# EAGLE schematic jellyFish_schematic (EAGLE 9.6.2)
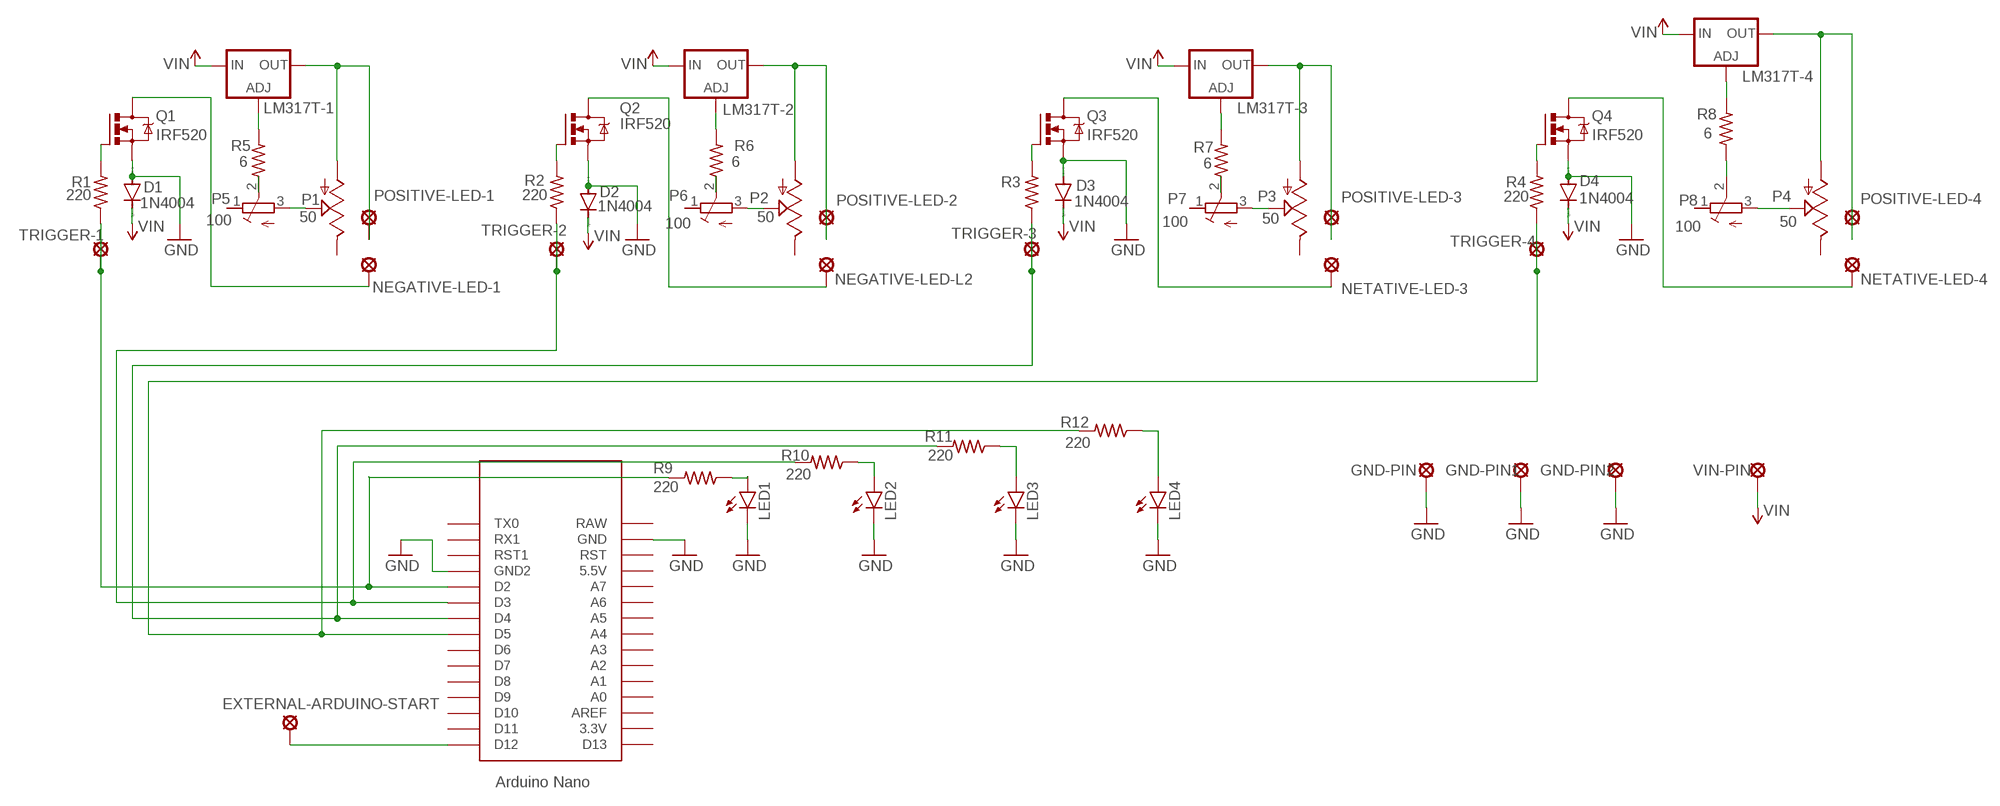
[diagram p0: schematic, sheet 1]

## Parts
D1  1N4004  [DO41-10]
D2  1N4004  [DO41-10]
D3  1N4004  [DO41-10]
D4  1N4004  [DO41-10]
EXTERNAL-ARDUINO-START  LSP10  [LSP10]
GND-PIN  LSP10  [LSP10]
GND-PIN1  LSP10  [LSP10]
GND-PIN2  LSP10  [LSP10]
LED1  LEDCHIPLED_0805  [CHIPLED_0805]
LED2  LEDCHIPLED_0805  [CHIPLED_0805]
LED3  LEDCHIPLED_0805  [CHIPLED_0805]
LED4  LEDCHIPLED_0805  [CHIPLED_0805]
LM317T-1  LM317TS  [317TS]
LM317T-2  LM317TS  [317TS]
LM317T-3  LM317TS  [317TS]
LM317T-4  LM317TS  [317TS]
NEGATIVE-LED-1  LSP10  [LSP10]
NEGATIVE-LED-L2  LSP10  [LSP10]
NETATIVE-LED-3  LSP10  [LSP10]
NETATIVE-LED-4  LSP10  [LSP10]
P1  50  TRIM_US-S63P  [S63P]
P2  50  TRIM_US-S63P  [S63P]
P3  50  TRIM_US-S63P  [S63P]
P4  50  TRIM_US-S63P  [S63P]
P5  100  R-TRIMMT93YA  [RTRIMT93YA]
P6  100  R-TRIMMT93YA  [RTRIMT93YA]
P7  100  R-TRIMMT93YA  [RTRIMT93YA]
P8  100  R-TRIMMT93YA  [RTRIMT93YA]
POSITIVE-LED-1  POSITIVE LED  LSP10  [LSP10]
POSITIVE-LED-2  LSP10  [LSP10]
POSITIVE-LED-3  LSP10  [LSP10]
POSITIVE-LED-4  LSP10  [LSP10]
Q1  IRF520  [TO220BV]
Q2  IRF520  [TO220BV]
Q3  IRF520  [TO220BV]
Q4  IRF520  [TO220BV]
R1  220  R-US_R0805  [R0805]
R2  220  R-US_R0805  [R0805]
R3  220  R-US_R0805  [R0805]
R4  220  R-US_R0805  [R0805]
R5  6  R-US_R0805  [R0805]
R6  6  R-US_R0805  [R0805]
R7  6  R-US_R0805  [R0805]
R8  6  R-US_R0805  [R0805]
R9  220  R-US_R0805  [R0805]
R10  220  R-US_R0805  [R0805]
R11  220  R-US_R0805  [R0805]
R12  220  R-US_R0805  [R0805]
TRIGGER-1  LSP10  [LSP10]
TRIGGER-2  LSP10  [LSP10]
TRIGGER-3  LSP10  [LSP10]
TRIGGER-4  LSP10  [LSP10]
U$1  NANO  [NANO]
VIN-PIN  LSP10  [LSP10]

## Nets
GND: D1.A D2.A D3.A D4.A GND-PIN1.MP GND-PIN2.MP GND-PIN.MP LED1.C LED2.C LED3.C LED4.C Q1.S Q2.S Q3.S Q4.S U$1.GND U$1.GND1(GND2)
N$1: NEGATIVE-LED-1.MP Q1.D
N$2: Q1.G R1.2
N$3: R1.1 R9.2 TRIGGER-1.MP U$1.D2
N$4: Q2.G R2.2
N$5: P6.2(S) R6.1
N$6: R2.1 R10.2 TRIGGER-2.MP U$1.D3
N$7: LM317T-3.1(ADJ) R7.2
N$8: LM317T-2.1(ADJ) R6.2
N$9: Q3.G R3.2
N$10: R3.1 R11.2 TRIGGER-3.MP U$1.D4
N$11: P7.2(S) R7.1
N$12: P3.S P7.3(A)
N$13: LM317T-1.1(ADJ) R5.2
N$14: LM317T-3.2(OUT) P3.A POSITIVE-LED-3.MP
N$16: P1.S P5.3(A)
N$17: LM317T-1.2(OUT) P1.A POSITIVE-LED-1.MP
N$18: P2.S P6.3(A)
N$19: LM317T-2.2(OUT) P2.A POSITIVE-LED-2.MP
N$20: NEGATIVE-LED-L2.MP Q2.D
N$21: NETATIVE-LED-3.MP Q3.D
N$22: Q4.G R4.2
N$23: R4.1 R12.2 TRIGGER-4.MP U$1.D5
N$24: NETATIVE-LED-4.MP Q4.D
N$25: LM317T-4.1(ADJ) R8.2
N$26: P8.2(S) R8.1
N$27: P4.S P8.3(A)
N$28: LM317T-4.2(OUT) P4.A POSITIVE-LED-4.MP
N$30: LED1.A R9.1
N$31: LED2.A R10.1
N$32: LED3.A R11.1
N$33: LED4.A R12.1
N$34: EXTERNAL-ARDUINO-START.MP U$1.D12
P5: P5.2(S) R5.1
VIN: D1.C D2.C D3.C D4.C LM317T-1.3(IN) LM317T-2.3(IN) LM317T-3.3(IN) LM317T-4.3(IN) VIN-PIN.MP
Unconnected: P1.E P2.E P3.E P4.E P5.1(E) P6.1(E) P7.1(E) P8.1(E) U$1.3.3V U$1.5V(5.5V) U$1.A0 U$1.A1 U$1.A2 U$1.A3 U$1.A4 U$1.A5 U$1.A6 U$1.A7 U$1.AREF U$1.D6 U$1.D7 U$1.D8 U$1.D9 U$1.D10 U$1.D11 U$1.D13 U$1.ICSP1 U$1.ICSP2 U$1.ICSP3 U$1.ICSP4 U$1.ICSP5 U$1.ICSP6 U$1.RAW U$1.RST U$1.RST1 U$1.RX1 U$1.TX0

## Library data of the parts
D1-D4 = diode:1N4004: DIODE general purpose rectifier, 1 A
EXTERNAL-ARDUINO-START GND-PIN GND-PIN1 GND-PIN2 NEGATIVE-LED-1 NEGATIVE-LED-L2 NETATIVE-LED-3 NETATIVE-LED-4 POSITIVE-LED-1-POSITIVE-LED-4 TRIGGER-1-TRIGGER-4 VIN-PIN = solpad:LSP10: SOLDER PAD drill 1.0 mm, distributor Buerklin, 12H555
LED1-LED4 = led:LED: LED OSRAM: - CHIPLED LG R971, LG N971, LY N971, LG Q971, LY Q971, LO R971, LY R971 LH N974, LH R974 LS Q976, LO Q976, LY Q976 LO Q996 - Hyper CHIPLED LW Q18S LB Q993, LB Q99A, LB R99A - SideLED LS A670, LO A670, LY A670, LG A670, LP A670 LB A673, LV A673, LT A673, LW A673 LH A674 LY A675 LS A676, LA A676, LO A676, LY A676, LW A676 LS A679, LY A679, LG A679 - Hyper Micro SIDELED® LS Y876, LA Y876, LO Y876, LY Y876 LT Y87S - SmartLED LW L88C, LW L88S LB L89C, LB L89S, LG L890 LS L89K, LO L89K, LY L89K LS L896, LA L896, LO L896, LY L896 - TOPLED LS T670, LO T670, LY T670, LG T670, LP T670 LSG T670, LSP T670, LSY T670, LOP T670, LYG T670 LG T671, LOG T671, LSG T671 LB T673, LV T673, LT T673, LW T673 LH T674 LS T676, LA T676, LO T676, LY T676, LB T676, LH T676, LSB T676, LW T676 LB T67C, LV T67C, LT T67C, LS T67K, LO T67K, LY T67K, LW E67C LS E67B, LA E67B, LO E67B, LY E67B, LB E67C, LV E67C, LT E67C LW T67C LS T679, LY T679, LG T679 LS T770, LO T770, LY T770, LG T770, LP T770 LB T773, LV T773, LT T773, LW T773 LH T774 LS E675, LA E675, LY E675, LS T675 LS T776, LA T776, LO T776, LY T776, LB T776 LHGB T686 LT T68C, LB T68C - Hyper Mini TOPLED® LB M676 - Mini TOPLED Santana® LG M470 LS M47K, LO M47K, LY M47K Source: http://www.osram.convergy.de LUXEON: - LUMILED® LXK2-PW12-R00, LXK2-PW12-S00, LXK2-PW14-U00, LXK2-PW14-V00 LXK2-PM12-R00, LXK2-PM12-S00, LXK2-PM14-U00 LXK2-PE12-Q00, LXK2-PE12-R00, LXK2-PE12-S00, LXK2-PE14-T00, LXK2-PE14-U00 LXK2-PB12-K00, LXK2-PB12-L00, LXK2-PB12-M00, LXK2-PB14-N00, LXK2-PB14-P00, LXK2-PB14-Q00 LXK2-PR12-L00, LXK2-PR12-M00, LXK2-PR14-Q00, LXK2-PR14-R00 LXK2-PD12-Q00, LXK2-PD12-R00, LXK2-PD12-S00 LXK2-PH12-R00, LXK2-PH12-S00 LXK2-PL12-P00, LXK2-PL12-Q00, LXK2-PL12-R00 Source: www.luxeon.com KINGBRIGHT: KA-3528ASYC Source: www.kingbright.com
LM317T-1-LM317T-4 = v-reg:LM317TS: VOLTAGE REGULATOR
P1-P4 = pot:TRIM_US-: POTENTIOMETER
P5-P8 = rcl:R-TRIMM: Trimm resistor; SPICEMODEL: X; SPICEPREFIXL: POT
Q1-Q4 = transistor-power:IRF520: HEXFET Power MOSFET
R1-R12 = rcl:R-US_: RESISTOR, American symbol; SPICEPREFIX: R
U$1 = Arduino-clone:NANO: Arduino Nano

## Net classes
0 default: clearance 0.205 mm